# EAGLE design Nomorobo85-1 (EAGLE 7.7.0)
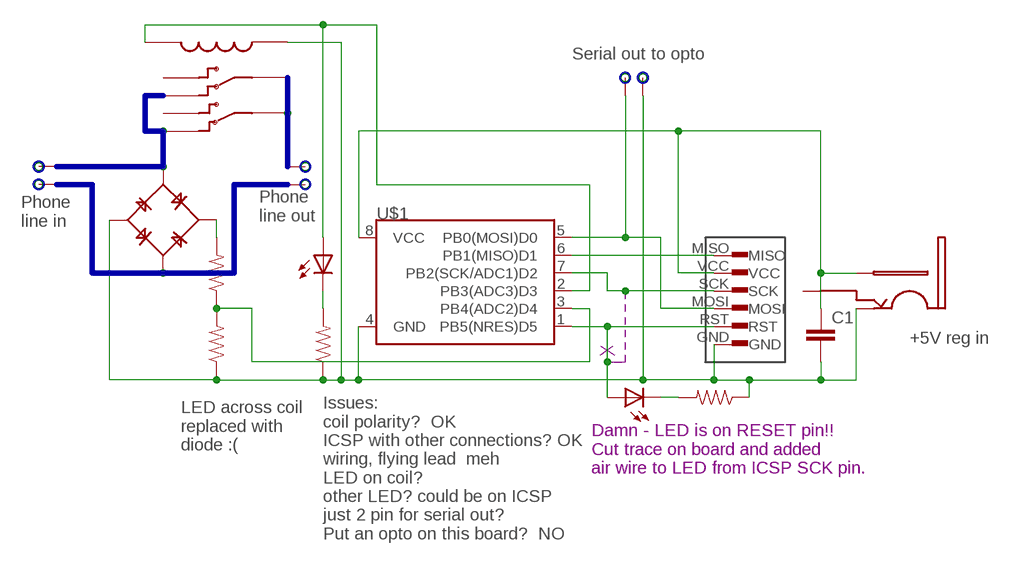
[diagram p0: schematic, sheet 1]

## Parts
C1  CAP1206  [1206]
U$1  ATTINY85SO08-I-HAVE-THESE  [SO08-EIAJ]
U$2  RESISTOR1206WW  [1206WW]
U$3  RESISTOR1206WW  [1206WW]
U$4  RESISTOR1206WW  [1206WW]
U$5  BRIDGE-ROUNDMY-600V-1A  [BRIDGE-ROUND]
U$6  M2X3-HEADERICSP-LONGPADS  [M2X3-LONGPADS]
U$7  SOLDER-PAD-2LONGPADS  [02P]
U$8  SOLDER-PAD-2LONGPADS  [02P]
U$9  RESISTOR1206WW  [1206WW]
U$10  BARREL-COAX-PWR  [BARREL-COAX-CONNECTOR]
U$11  LED-12061206  [1206W]
U$12  RELAY-DPDT  [RELAY-DPDT]
U$13  SOLDER-PAD-2LONGPPAD2  [SOLDER-PAD-2-LONGPADS]
U$14  LED-12061206  [1206W]

## Nets
GND: C1.2 U$1.4(GND) U$2.1 U$4.1 U$5.OUT-(V-) U$6.GND U$9.1 U$10.SHELL U$12.COIL+ U$13.P$2
N$1: U$1.1(PB5(NRES)D5) U$6.RST U$14.1(A)
N$2: U$5.AC1(IN1) U$7.1 U$12.NC1 U$12.NC2
N$3: U$1.5(PB0(MOSI)D0) U$6.MOSI U$13.P$3
N$4: U$1.2(PB3(ADC3)D3) U$11.1(A) U$12.COIL-
N$5: U$1.6(PB1(MISO)D1) U$6.MISO
N$6: U$8.2 U$12.COM1 U$12.COM2
N$8: U$1.3(PB4(ADC2)D4) U$3.1 U$4.2
N$9: U$3.2 U$5.OUT+(V+)
N$11: U$9.2 U$11.2(C)
N$12: U$5.AC2(IN2) U$7.2 U$8.1
N$13: U$2.2 U$14.2(C)
N$15: U$1.7(PB2(SCK/ADC1)D2) U$6.SCK
VCC: C1.1 U$1.8(VCC) U$6.VCC U$10.PIN
Unconnected: U$10.SWITCH U$12.NO1 U$12.NO2

## Buses
B$1
B$2
B$3

## Notes on the sheet
- Serial out to opto
- Phone
  line out
- Phone
  line in
- +5V reg in
- LED across coil
  replaced with 
  diode :(
- Damn - LED is on RESET pin!!
  Cut trace on board and added
  air wire to LED from ICSP SCK pin.
- Issues:
  coil polarity?  OK
  ICSP with other connections? OK
  wiring, flying lead  meh
  LED on coil?
  other LED? could be on ICSP
  just 2 pin for serial out?
  Put an opto on this board?  NO

## Library data of the parts
C1 = jim:CAP: Capacitor Standard size C capacitor.
U$1 = jim2:ATTINY85
U$2-U$4 U$9 = jim2:RESISTOR
U$5 = jim2:BRIDGE-ROUND
U$6 = jim2:M2X3-HEADER
U$7 U$8 U$13 = jim2:SOLDER-PAD-2
U$10 = jim2:BARREL-COAX-PWR
U$11 U$14 = jim2:LED-1206
U$12 = jim2:RELAY-DPDT

## Board
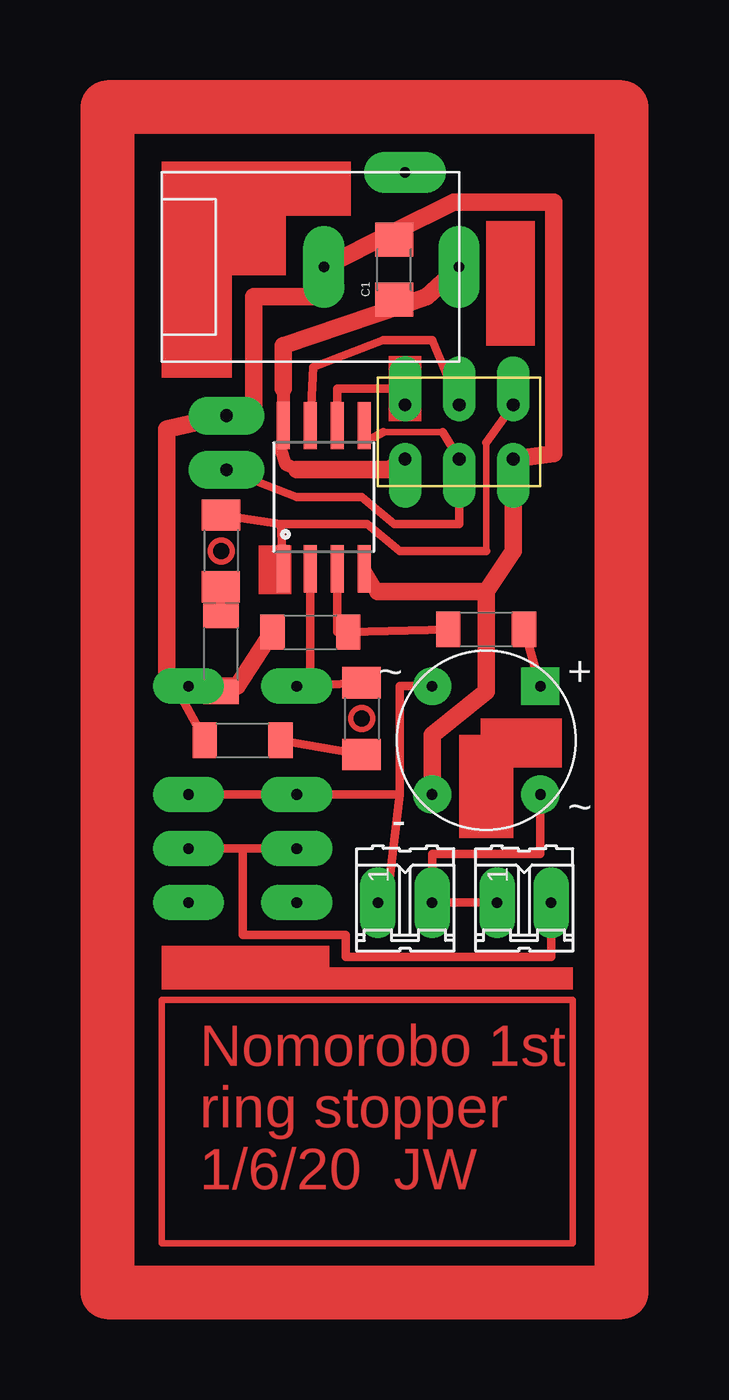
[diagram p1: board, top side]
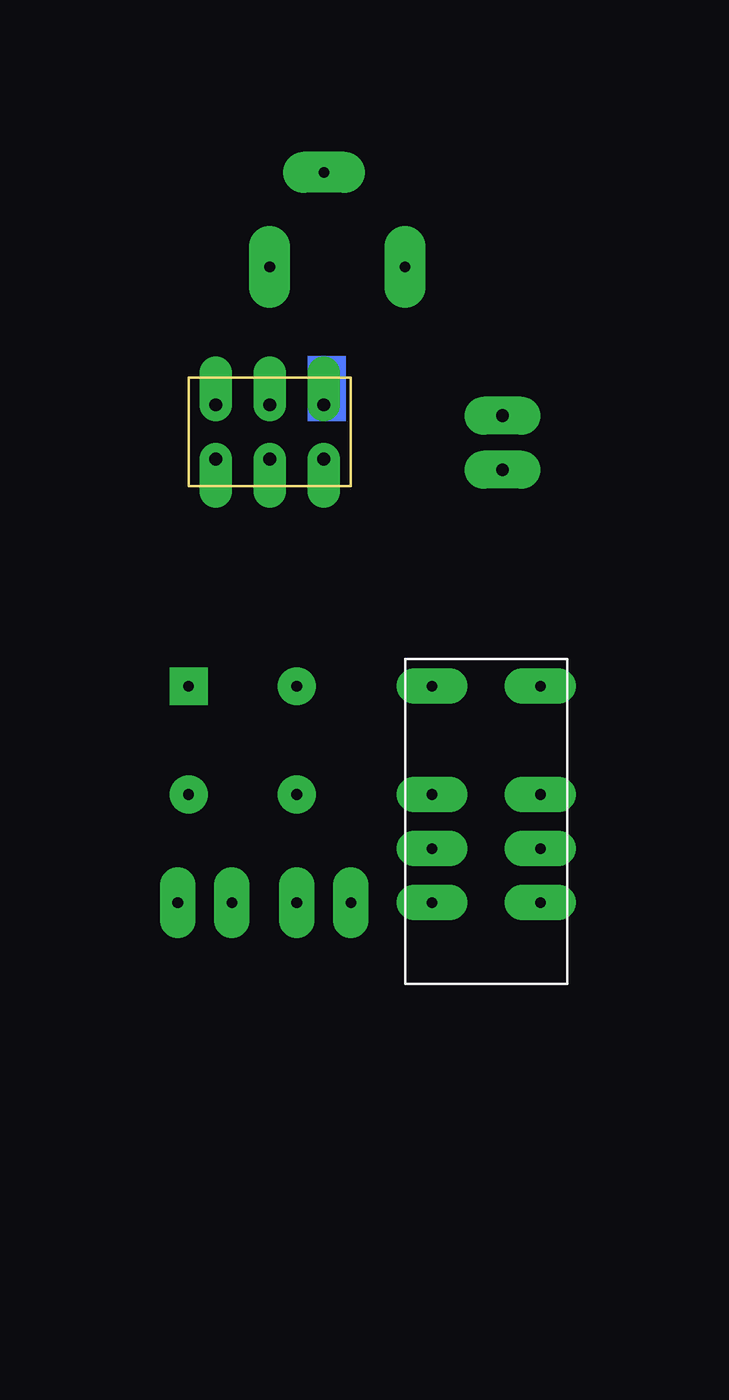
[diagram p2: board, bottom side, seen from below]

Size 7.62 x 5.08 mm. Coordinates in mm from the lower left corner, seen from the top.
Copper layers (1*16): Top 0.035mm / dielectric 1.5mm / Bottom 0.035mm
Design rules "default": minimum track width 10mil, minimum drill 24mil, track to track 8mil, track to pad 8mil, pad to pad 8mil, via to via 8mil, smd to smd 8mil, copper to edge 40mil, drill to drill 8mil, minimum pad ring 10mil, minimum via ring 8mil, stop-mask expansion 4mil, vias tented up to drill 0mil, thermal gap 10mil

### Footprints (pad centres in the part's own frame; a part is rotated, then mirrored left to right if it is on the bottom)
1206 = smd 1.6 x 1.8: 1 -1.4,0; 2 1.4,0
SO08-EIAJ = smd 0.61 x 2.21: 1 -1.905,-3.378; 2 -0.635,-3.378; 3 0.635,-3.378; 4 1.905,-3.378; 5 1.905,3.353; 6 0.635,3.353; 7 -0.635,3.353; 8 -1.905,3.353
1206WW = smd 1.143 x 1.651: 1 -1.781,0.004; 2 1.781,0.004
BRIDGE-ROUND = drill 0.5 pad 1.778: AC1 -2.54,2.54; AC2 2.54,-2.54; OUT- -2.54,-2.54 | drill 0.5 pad 1.778 square: OUT+ 2.54,2.54
M2X3-LONGPADS = drill 0.6 pad 1.524 offset: GND -3.81,0; MISO -1.27,5.08; MOSI -3.81,2.54; RST -1.27,0; SCK -1.27,2.54; VCC -3.81,5.08
02P = drill 0.5 pad 1.676 long: 1 -1.27,0; 2 1.27,0
BARREL-COAX-CONNECTOR = drill 0.5 pad 1.93 long: PIN -0.635,7.62; SHELL -0.635,1.27; SWITCH -5.08,5.08
1206W = smd 1.473 x 1.8: 1 -1.684,-0.008; 2 1.679,-0.011
RELAY-DPDT = drill 0.5 pad 1.676 long: COIL+ 2.54,6.35; COIL- -2.54,6.35; COM1 -2.54,-1.27; COM2 2.54,-1.27; NC1 -2.54,1.27; NC2 2.54,1.27; NO1 -2.54,-3.81; NO2 2.54,-3.81
SOLDER-PAD-2-LONGPADS = drill 0.6 pad 1.778 long: P$2 0,1.27; P$3 0,-1.27

### Placement (x,y rotation side)
C1  0.76,10.16 90 top  (outside the outline)
U$1  -2.54,-0.51 0 top
U$2  -7.37,-7.87 90 top  (outside the outline)
U$3  5.08,-6.73 0 top  (outside the outline)
U$4  -3.17,-6.86 0 top  (outside the outline)
U$5  5.08,-11.94 0 top  (outside the outline)
U$6  6.35,5.08 90 top
U$7  1.27,-19.56 0 top  (outside the outline)
U$8  6.86,-19.56 0 top  (outside the outline)
U$9  -6.35,-11.94 0 top  (outside the outline)
U$10  -3.81,9.65 270 top  (outside the outline)
U$11  -0.76,-10.92 270 top  (outside the outline)
U$12  -6.35,-15.75 0 bottom  (outside the outline)
U$13  -7.11,2.03 0 top  (outside the outline)
U$14  -7.37,-3.05 270 top  (outside the outline)

### Tracks (layer width: path | path; a pad name or v marks a point on that pad's centre or on a via)
GND
  Top 0.406: -9.52,-9.4 U$9.1 | U$2.1 U$12.COIL+
  Top 0.61: 0,-4.95 U$1.4
  Top 0.813: -7.24,-9.4 U$12.COIL+ -9.52,-9.4 | 5.08,-4.95 0,-4.95 | U$4.1 -6.6,-9.4 -7.24,-9.4 | U$5.OUT- 2.54,-11.68 5.08,-9.65 5.08,-4.95 | 0.76,11.94 U$10.SHELL -2.79,8.89 -5.84,8.89 -5.84,3.81 U$13.P$2 -9.91,2.67 -9.91,-9.27 -7.24,-9.4 | 0.76,11.94 3.56,13.34 8.26,13.34 8.26,1.52 U$6.GND 6.35,-3.05 5.08,-4.95 | C1.2 0.76,11.94
N$1
  Top 0.305: 5.08,-3.05 5.08,2.03
  Top 0.406: -4.57,-1.78 U$1.1 | -4.57,-1.78 -0.51,-1.78 1.02,-3.05 5.08,-3.05 | 5.08,2.03 U$6.RST | U$14.1 -4.57,-1.78
N$2
  Top 0.406: U$7.1 0.51,-18.8 1.02,-14.48 | 1.02,-14.48 1.02,-9.4 U$5.AC1 | U$12.NC2 U$12.NC1 1.02,-14.48
N$3
  Top 0.305: 3.05,2.54 0.25,2.54
  Top 0.406: U$1.5 -0.63,2.03 0.25,2.54 | 3.05,2.54 U$6.MOSI 3.81,-1.78 0.76,-1.78 -0.76,-0.51 -3.81,-0.51 U$13.P$3
N$4
  Top 0.406: U$1.2 -3.17,-8.76 U$12.COIL- U$11.1
N$5
  Top 0.406: U$1.6 -1.9,4.57 0.64,4.57 U$6.MISO
N$6
  Top 0.406: U$12.COM2 -6.35,-17.02 | -6.35,-17.02 U$12.COM1 | -6.35,-17.02 -6.35,-21.08 -1.52,-21.08 -1.52,-22.1 8.13,-22.1 U$8.2 7.62,-19.56
N$7
  Top 2.54: -12.7,17.78 -12.7,-37.85 11.43,-37.85 11.43,17.78 -12.7,17.78
N$8
  Top 0.406: U$3.1 U$4.2 -1.9,-6.86 U$1.3
N$9
  Top 0.406: U$5.OUT+ U$3.2
N$10
  Top 0.305: -10.16,-35.56 9.14,-35.56 9.14,-24.13 -10.16,-24.13 -10.16,-35.56
N$11
  Top 0.406: U$9.2 U$11.2
N$12
  Top 0.406: U$5.AC2 7.62,-17.27 2.54,-17.27 U$7.2 U$8.1
N$13
  Top 0.406: U$14.2 U$2.2
N$15
  Top 0.406: U$1.7 -3.05,5.59 0.25,6.86 2.54,6.86 U$6.SCK
VCC
  Top 0.406: -4.57,1.78 U$1.8
  Top 0.61: -4.44,4.57 U$1.8 | -3.81,0.76 -4.32,1.02 -4.57,1.78
  Top 0.813: 1.22,8.52 2.29,8.89 U$10.PIN | 1.22,8.52 -4.44,6.6 -4.44,4.57 | U$6.VCC 0.51,0.76 -3.81,0.76 | C1.1 1.22,8.52
(copper drawn outside any net)
  shapes: Top area x11, Top circle x2

### Text on the board
Top: Nomorobo 1st / ring stopper / 1/6/20 JW